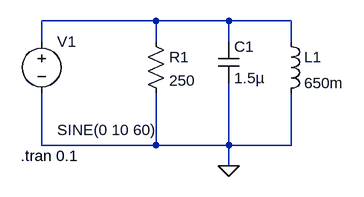
[diagram p0: schematic RLC_Parallel.asc]
RLC_Parallel.asc, the LTspice schematic file:
Version 4.1
SHEET 1 880 680
WIRE 176 80 0 80
WIRE 288 80 176 80
WIRE 384 80 288 80
WIRE 0 112 0 80
WIRE 176 112 176 80
WIRE 288 112 288 80
WIRE 384 112 384 80
WIRE 0 272 0 192
WIRE 176 272 176 192
WIRE 176 272 0 272
WIRE 288 272 288 176
WIRE 288 272 176 272
WIRE 384 272 384 192
WIRE 384 272 288 272
WIRE 288 304 288 272
FLAG 288 304 0
SYMBOL voltage 0 96 R0
WINDOW 123 24 124 Left 2
WINDOW 39 0 0 Left 0
WINDOW 3 24 152 Left 2
SYMATTR Value SINE(0 10 60)
SYMATTR InstName V1
SYMBOL res 160 96 R0
SYMATTR InstName R1
SYMATTR Value 250
SYMBOL cap 272 112 R0
SYMATTR InstName C1
SYMATTR Value 1.5µ
SYMBOL ind 368 96 R0
SYMATTR InstName L1
SYMATTR Value 650m
SYMATTR SpiceLine Rser=1m
TEXT -32 288 Left 2 !.tran 0.1

The netlist it stands for:
* RLC_Parallel.asc
V1 N001 0 SINE(0 10 60)
R1 N001 0 250
C1 N001 0 1.5µ
L1 N001 0 650m Rser=1m
.tran 0.1
.backanno
.end